# Altium schematic sheet CoilGun_Schematic.SchDoc
size 420 x 297 mm; SheetNumber: 1; SheetTotal: 1
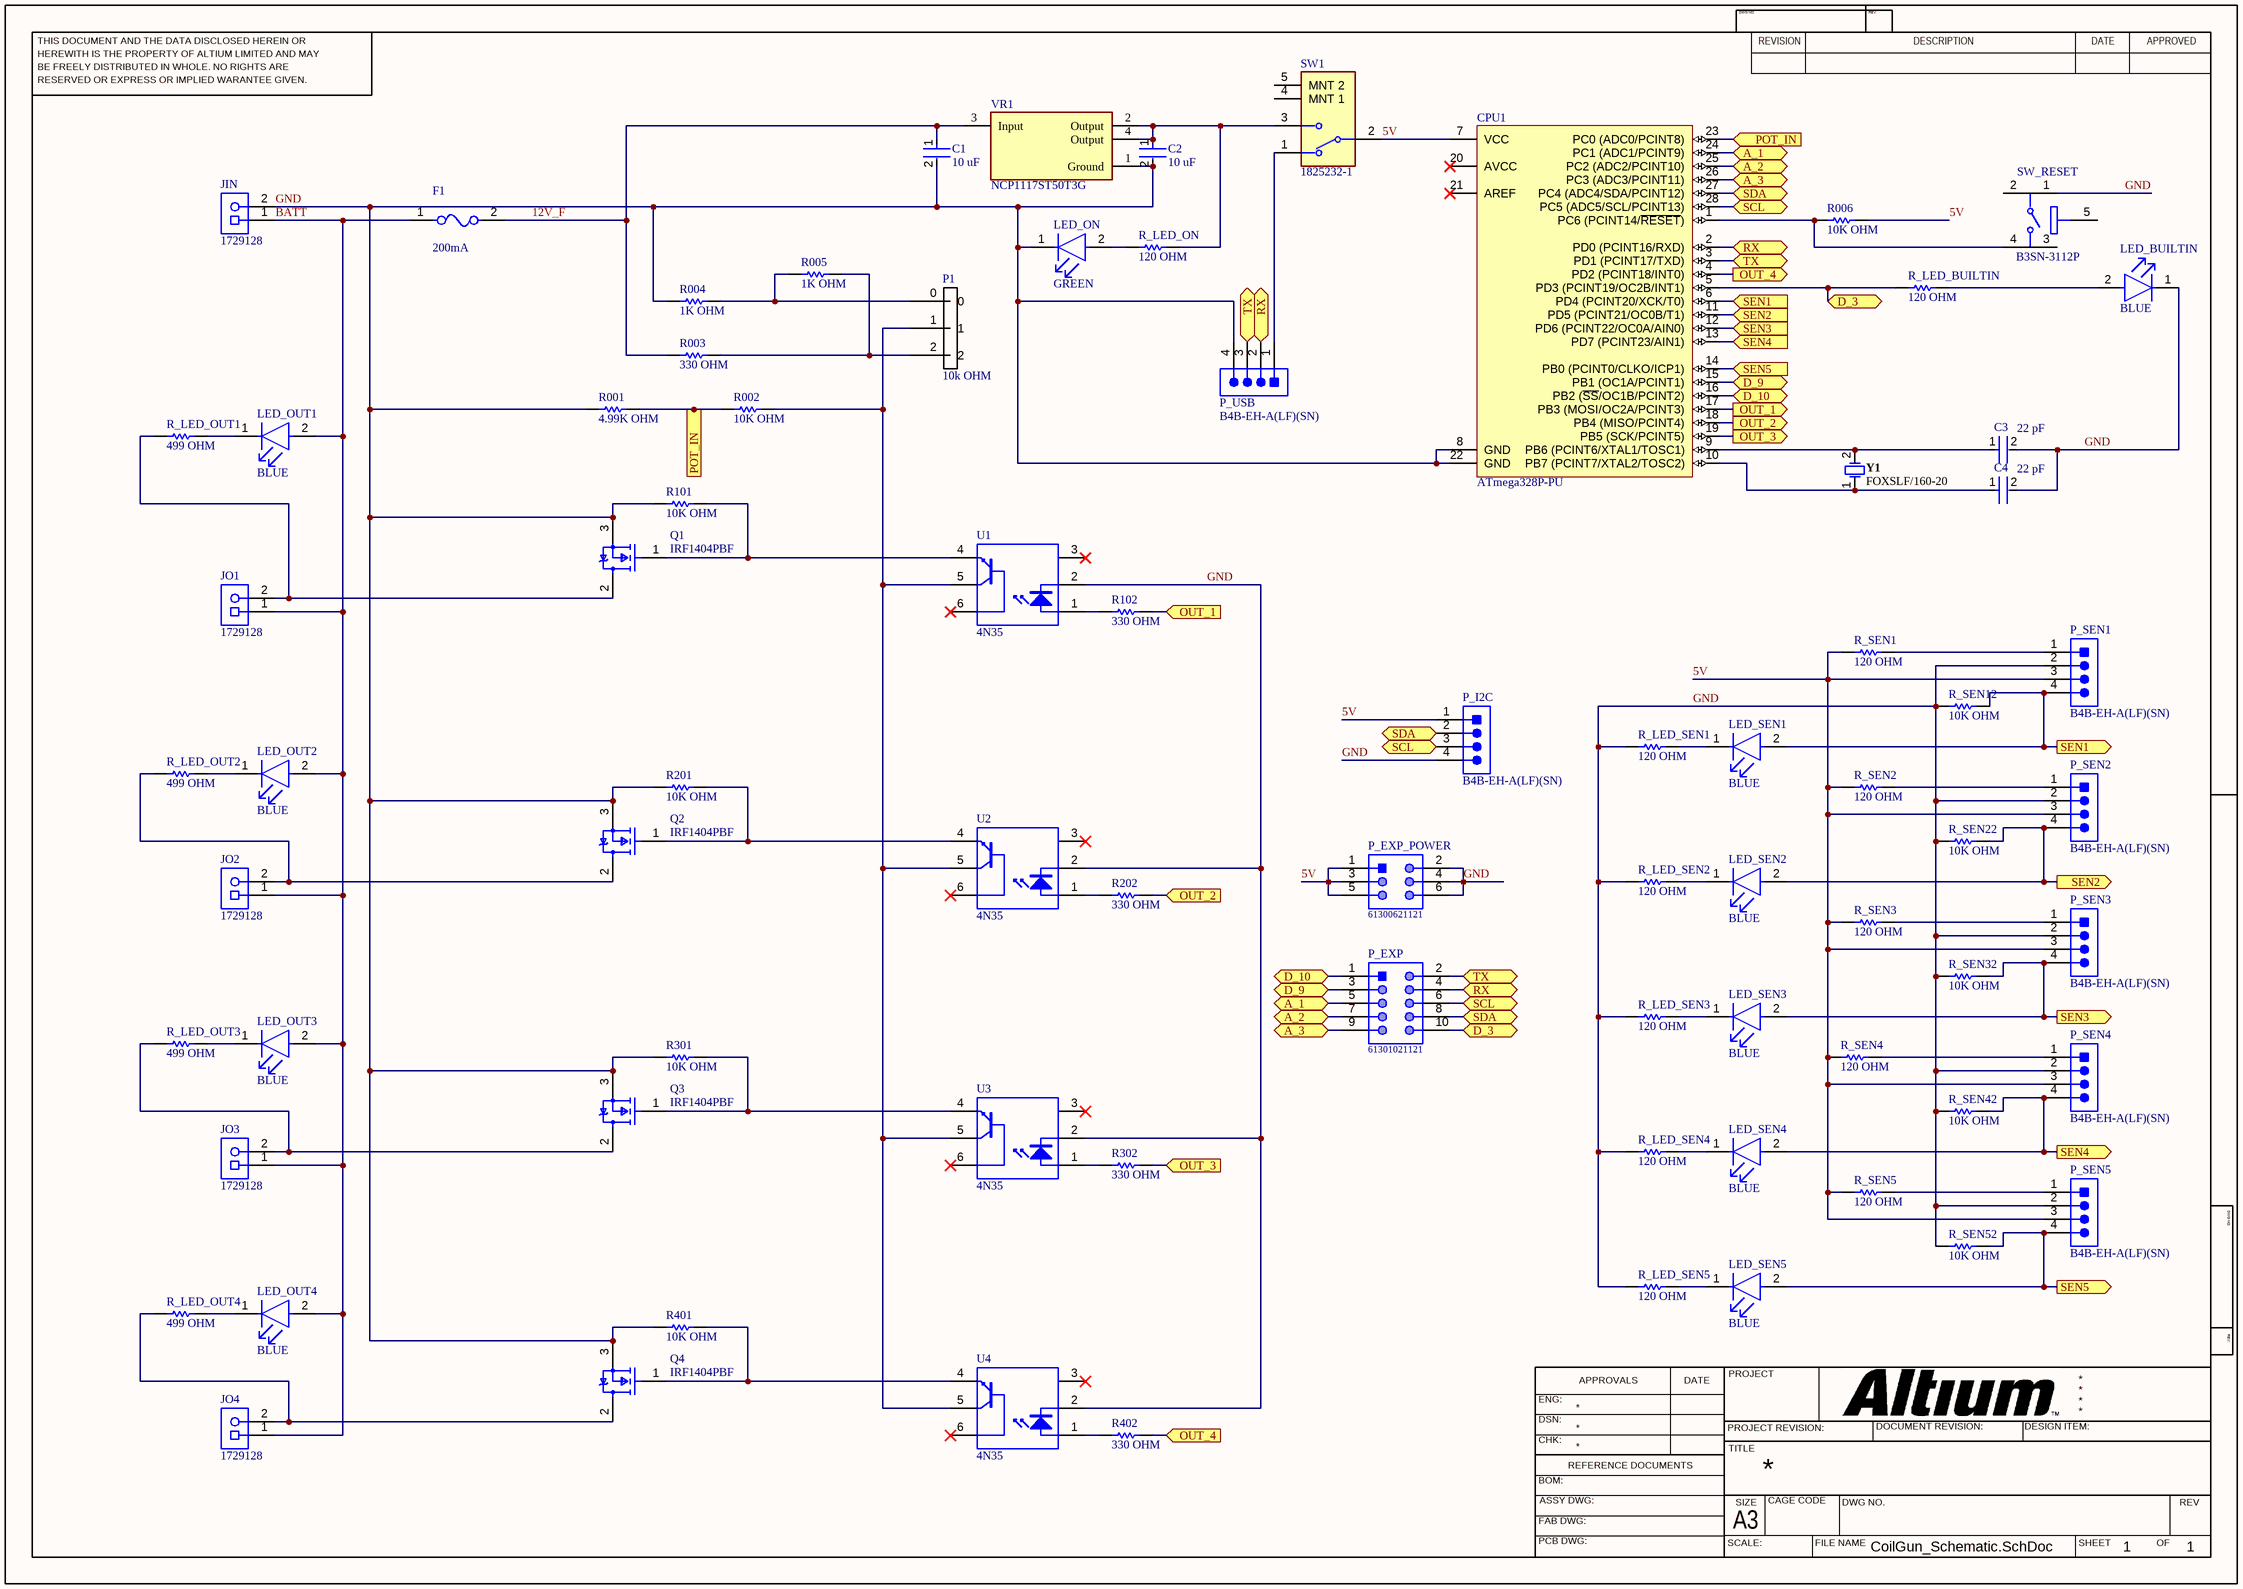
[diagram p0: CoilGun_Schematic.SchDoc]

## Parts
C1  10 uF  [FP-MK316L-MFG]
C2  10 uF  [FP-MK316L-MFG]
C3  22 pF  [FP-C0805C-DN-MFG]
C4  22 pF  [FP-C0805C-DN-MFG]
CPU1  ATmega328P-PU  [28P3]
F1  200mA  [FP-MF-R030-MFG]
JIN  1729128  [PHOE-1729128-2_V]
JO1  1729128  [PHOE-1729128-2_V]
JO2  1729128  [PHOE-1729128-2_V]
JO3  1729128  [PHOE-1729128-2_V]
JO4  1729128  [PHOE-1729128-2_V]
LED_BUILTIN  BLUE  [FP-LTST-C150AKT-MFG]
LED_ON  GREEN  [FP-LTST-C150AKT-MFG]
LED_OUT1  BLUE  [FP-LTST-C150AKT-MFG]
LED_OUT2  BLUE  [FP-LTST-C150AKT-MFG]
LED_OUT3  BLUE  [FP-LTST-C150AKT-MFG]
LED_OUT4  BLUE  [FP-LTST-C150AKT-MFG]
LED_SEN1  BLUE  [FP-LTST-C150AKT-MFG]
LED_SEN2  BLUE  [FP-LTST-C150AKT-MFG]
LED_SEN3  BLUE  [FP-LTST-C150AKT-MFG]
LED_SEN4  BLUE  [FP-LTST-C150AKT-MFG]
LED_SEN5  BLUE  [FP-LTST-C150AKT-MFG]
P1  10k OHM  [POT]
P_EXP  61301021121  [61301021121]
P_EXP_POWER  61300621121  [61300621121]
P_I2C  B4B-EH-A(LF)(SN)  [JST-B4B-EH-A_V]
P_SEN1  B4B-EH-A(LF)(SN)  [JST-B4B-EH-A_V]
P_SEN2  B4B-EH-A(LF)(SN)  [JST-B4B-EH-A_V]
P_SEN3  B4B-EH-A(LF)(SN)  [JST-B4B-EH-A_V]
P_SEN4  B4B-EH-A(LF)(SN)  [JST-B4B-EH-A_V]
P_SEN5  B4B-EH-A(LF)(SN)  [JST-B4B-EH-A_V]
P_USB  B4B-EH-A(LF)(SN)  [JST-B4B-EH-A_V]
Q1  IRF1404PBF  [FP-PG-TO220-3-MFG]
Q2  IRF1404PBF  [FP-PG-TO220-3-MFG]
Q3  IRF1404PBF  [FP-PG-TO220-3-MFG]
Q4  IRF1404PBF  [FP-PG-TO220-3-MFG]
R001  4.99K OHM  [RESC3116X65X40LL10T20]
R002  10K OHM  [RESC3116X65X40ML10T20]
R003  330 OHM  [RESC2013X60X35LL10T20]
R004  1K OHM  [RESC3116X65X40ML10T20]
R005  1K OHM  [RESC3116X65X40ML10T20]
R006  10K OHM  [RESC3116X65X40ML10T20]
R101  10K OHM  [RESC3116X65X40ML10T20]
R102  330 OHM  [RESC2013X60X35LL10T20]
R201  10K OHM  [RESC3116X65X40ML10T20]
R202  330 OHM  [RESC2013X60X35LL10T20]
R301  10K OHM  [RESC3116X65X40ML10T20]
R302  330 OHM  [RESC2013X60X35LL10T20]
R401  10K OHM  [RESC3116X65X40ML10T20]
R402  330 OHM  [RESC2013X60X35LL10T20]
R_LED_BUILTIN  120 OHM  [RESC3216X70X50ML20T25]
R_LED_ON  120 OHM  [RESC3216X70X50ML20T25]
R_LED_OUT1  499 OHM  [RESC1206(3216)_N]
R_LED_OUT2  499 OHM  [RESC1206(3216)_N]
R_LED_OUT3  499 OHM  [RESC1206(3216)_N]
R_LED_OUT4  499 OHM  [RESC1206(3216)_N]
R_LED_SEN1  120 OHM  [RESC3216X70X50ML20T25]
R_LED_SEN2  120 OHM  [RESC3216X70X50ML20T25]
R_LED_SEN3  120 OHM  [RESC3216X70X50ML20T25]
R_LED_SEN4  120 OHM  [RESC3216X70X50ML20T25]
R_LED_SEN5  120 OHM  [RESC3216X70X50ML20T25]
R_SEN1  120 OHM  [RESC3216X70X50ML20T25]
R_SEN2  120 OHM  [RESC3216X70X50ML20T25]
R_SEN3  120 OHM  [RESC3216X70X50ML20T25]
R_SEN4  120 OHM  [RESC3216X70X50ML20T25]
R_SEN5  120 OHM  [RESC3216X70X50ML20T25]
R_SEN12  10K OHM  [RESC3116X65X40ML10T20]
R_SEN22  10K OHM  [RESC3116X65X40ML10T20]
R_SEN32  10K OHM  [RESC3116X65X40ML10T20]
R_SEN42  10K OHM  [RESC3116X65X40ML10T20]
R_SEN52  10K OHM  [RESC3116X65X40ML10T20]
SW1  1825232-1  [FP-1825232-1-MFG]
SW_RESET  B3SN-3112P  [FP-B3SN-3112P-MFG]
U1  4N35  [LTST-DIP-6_A]
U2  4N35  [LTST-DIP-6_A]
U3  4N35  [LTST-DIP-6_A]
U4  4N35  [LTST-DIP-6_A]
VR1  NCP1117ST50T3G  [FP-318H-MFG]
Y1  FOXSLF/160-20  [FOX-FOXSLF160-20]

## Ports
A_1 (bidir), A_2 (bidir), A_3 (bidir), D_3 (bidir), D_9 (bidir), D_10 (bidir), OUT_1 (in), OUT_1 (out), OUT_2 (in), OUT_2 (out), OUT_3 (in), OUT_3 (out), OUT_4 (in), OUT_4 (out), POT_IN (in), POT_IN (out), RX (bidir), SCL (bidir), SDA (bidir), SEN1 (in), SEN1 (out), SEN2 (in), SEN2 (out), SEN3 (in), SEN3 (out), SEN4 (in), SEN4 (out), SEN5 (in), SEN5 (out), TX (bidir)

## Nets
5V: CPU1.7(VCC) P_EXP_POWER.1 P_EXP_POWER.3 P_EXP_POWER.5 P_I2C.1 P_SEN1.3 P_SEN2.3 P_SEN3.3 P_SEN4.3 P_SEN5.3 R006.2 R_SEN1.1 R_SEN2.1 R_SEN3.1 R_SEN4.1 R_SEN5.1 SW1.2
12V_F: C1.1 F1.2 R003.1 VR1.3(Input)
A_1: CPU1.24(PC1_(ADC1/PCINT9)) P_EXP.5 ; port A_1
A_2: CPU1.25(PC2_(ADC2/PCINT10)) P_EXP.7 ; port A_2
A_3: CPU1.26(PC3_(ADC3/PCINT11)) P_EXP.9 ; port A_3
BATT: F1.1 JIN.1 JO1.1 JO2.1 JO3.1 JO4.1 LED_OUT1.2(A) LED_OUT2.2(A) LED_OUT3.2(A) LED_OUT4.2(A)
D_3: CPU1.5(PD3_(PCINT19/OC2B/INT1)) P_EXP.10 R_LED_BUILTIN.1 ; port D_3
D_9: CPU1.15(PB1_(OC1A/PCINT1)) P_EXP.3 ; port D_9
D_10: CPU1.16(PB2_(~{SS}/OC1B/PCINT2)) P_EXP.1 ; port D_10
GND: C1.2 C2.2 C3.2 C4.2 CPU1.8(GND) CPU1.22(GND) JIN.2 LED_BUILTIN.1(C) LED_ON.1(C) P_EXP_POWER.2 P_EXP_POWER.4 P_EXP_POWER.6 P_I2C.4 P_SEN1.2 P_SEN2.2 P_SEN3.2 P_SEN4.2 P_SEN5.2 P_USB.4 Q1.3(SOURCE) Q2.3(SOURCE) Q3.3(SOURCE) Q4.3(SOURCE) R001.1 R004.1 R101.1 R201.1 R301.1 R401.1 R_LED_SEN1.1 R_LED_SEN2.1 R_LED_SEN3.1 R_LED_SEN4.1 R_LED_SEN5.1 R_SEN12.1 R_SEN22.1 R_SEN32.1 R_SEN42.1 R_SEN52.1 SW_RESET.1 U1.2(C) U2.2(C) U3.2(C) U4.2(C) VR1.1(Ground)
OUT_1: CPU1.17(PB3_(MOSI/OC2A/PCINT3)) R102.2 ; port OUT_1
OUT_2: CPU1.18(PB4_(MISO/PCINT4)) R202.2 ; port OUT_2
OUT_3: CPU1.19(PB5_(SCK/PCINT5)) R302.2 ; port OUT_3
OUT_4: CPU1.4(PD2_(PCINT18/INT0)) R402.2 ; port OUT_4
POT_IN: CPU1.23(PC0_(ADC0/PCINT8)) R001.2 R002.1 ; port POT_IN
RX: CPU1.2(PD0_(PCINT16/RXD)) P_EXP.4 P_USB.2 ; port RX
SCL: CPU1.28(PC5_(ADC5/SCL/PCINT13)) P_EXP.6 P_I2C.3 ; port SCL
SDA: CPU1.27(PC4_(ADC4/SDA/PCINT12)) P_EXP.8 P_I2C.2 ; port SDA
SEN1: CPU1.6(PD4_(PCINT20/XCK/T0)) LED_SEN1.2(A) P_SEN1.4 R_SEN12.2 ; port SEN1
SEN2: CPU1.11(PD5_(PCINT21/OC0B/T1)) LED_SEN2.2(A) P_SEN2.4 R_SEN22.2 ; port SEN2
SEN3: CPU1.12(PD6_(PCINT22/OC0A/AIN0)) LED_SEN3.2(A) P_SEN3.4 R_SEN32.2 ; port SEN3
SEN4: CPU1.13(PD7_(PCINT23/AIN1)) LED_SEN4.2(A) P_SEN4.4 R_SEN42.2 ; port SEN4
SEN5: CPU1.14(PB0_(PCINT0/CLKO/ICP1)) LED_SEN5.2(A) P_SEN5.4 R_SEN52.2 ; port SEN5
TX: CPU1.3(PD1_(PCINT17/TXD)) P_EXP.2 P_USB.3 ; port TX
NetC2_1: C2.1 R_LED_ON.2 SW1.3 VR1.2(Output) VR1.4(Output)
NetC3_1: C3.1 CPU1.9(PB6_(PCINT6/XTAL1/TOSC1)) Y1.2
NetC4_1: C4.1 CPU1.10(PB7_(PCINT7/XTAL2/TOSC2)) Y1.1
NetCPU1_1: CPU1.1(PC6_(PCINT14/~{RESET})) R006.1 SW_RESET.4
NetJO1_2: JO1.2 Q1.2(DRAIN) R_LED_OUT1.1
NetJO2_2: JO2.2 Q2.2(DRAIN) R_LED_OUT2.1
NetJO3_2: JO3.2 Q3.2(DRAIN) R_LED_OUT3.1
NetJO4_2: JO4.2 Q4.2(DRAIN) R_LED_OUT4.1
NetLED_BUILTIN_2: LED_BUILTIN.2(A) R_LED_BUILTIN.2
NetLED_ON_2: LED_ON.2(A) R_LED_ON.1
NetLED_OUT1_1: LED_OUT1.1(C) R_LED_OUT1.2
NetLED_OUT2_1: LED_OUT2.1(C) R_LED_OUT2.2
NetLED_OUT3_1: LED_OUT3.1(C) R_LED_OUT3.2
NetLED_OUT4_1: LED_OUT4.1(C) R_LED_OUT4.2
NetLED_SEN1_1: LED_SEN1.1(C) R_LED_SEN1.2
NetLED_SEN2_1: LED_SEN2.1(C) R_LED_SEN2.2
NetLED_SEN3_1: LED_SEN3.1(C) R_LED_SEN3.2
NetLED_SEN4_1: LED_SEN4.1(C) R_LED_SEN4.2
NetLED_SEN5_1: LED_SEN5.1(C) R_LED_SEN5.2
NetP1_0: P1.0 R004.2 R005.1
NetP1_1: P1.1 R002.2 U1.5(C) U2.5(C) U3.5(C) U4.5(C)
NetP1_2: P1.2 R003.2 R005.2
NetP_SEN1_1: P_SEN1.1 R_SEN1.2
NetP_SEN2_1: P_SEN2.1 R_SEN2.2
NetP_SEN3_1: P_SEN3.1 R_SEN3.2
NetP_SEN4_1: P_SEN4.1 R_SEN4.2
NetP_SEN5_1: P_SEN5.1 R_SEN5.2
NetP_USB_1: P_USB.1 SW1.1
NetQ1_1: Q1.1(GATE) R101.2 U1.4(E)
NetQ2_1: Q2.1(GATE) R201.2 U2.4(E)
NetQ3_1: Q3.1(GATE) R301.2 U3.4(E)
NetQ4_1: Q4.1(GATE) R401.2 U4.4(E)
NetR102_1: R102.1 U1.1(A)
NetR202_1: R202.1 U2.1(A)
NetR302_1: R302.1 U3.1(A)
NetR402_1: R402.1 U4.1(A)

Not connected (* = marked no-connect by the designer): CPU1 20(AVCC)* 21(AREF)*; SW1 4(MNT_1) 5(MNT_2); SW_RESET 2 3 5; U1 3(NC)* 6(B)*; U2 3(NC)* 6(B)*; U3 3(NC)* 6(B)*; U4 3(NC)* 6(B)*

## Notes on the sheet
- THIS DOCUMENT AND THE DATA DISCLOSED HEREIN OR
- HEREWITH IS THE PROPERTY OF ALTIUM LIMITED AND MAY
- DWG NO:
- REVISION
- REV:
- DESCRIPTION
- DATE
- APPROVED
- BE FREELY DISTRIBUTED IN WHOLE. NO RIGHTS ARE
- RESERVED OR EXPRESS OR IMPLIED WARANTEE GIVEN.
- ENG:
- APPROVALS
- PROJECT
- DSN:
- CHK:
- REFERENCE DOCUMENTS
- PROJECT REVISION:
- TITLE
- DOCUMENT REVISION:
- DESIGN ITEM:
- BOM:
- FAB DWG:
- PCB DWG:
- ASSY DWG:
- SCALE:
- A3
- SIZE
- CAGE CODE
- FILE NAME
- DWG NO.
- SHEET
- OF
- REV

## Library data of the parts
C1 C2 = CMP-2000-06325-2: CAP CER 10UF 35V X5R 1206; Tolerance: 10%; RoHS Compliant: Yes; Case Code (Metric): 3216; Resistor Type: Ceramic; Dielectric: X5R; Mount: Surface Mount; Termination: SMD/SMT; Case Code (Imperial): 1206; Number of Pins: 2; Package Quantity: 2000; Length: 3.2mm; Max Operating Temperature: 85°C; Voltage Rating (DC): 35V; Packaging: Tape and Reel; Construction: Flat; Voltage Rating: 35V; Height: 1.6mm; Capacitance: 10uF; Width: 1.6mm; Min Operating Temperature: -55°C; Series: M; Case/Package: 1206; Thickness: 0.071inch
C3 C4 = CMP-03020-018552-1: CAP CER 22PF 50V C0G/NP0 0805; Manufacturer Part Number: C0805C220J5GAC7210; Manufacturer: KEMET; Material: Ceramic; Temperature Coefficient: 30ppm/°C; Tolerance: 0.05; Temperature Characteristic: C0G; Capacitance: 22 pF; Octopart: https://octopart.com/c0805c220j5gac7210-kemet-3882539; Automotive: No; ComponentLink2Description: Datasheet; Temperature Range High: +125°C; Height: 0.88mm; Device Class L3: Ceramic Capacitors; Lead Free: Yes; Package: C0805C-DN; Digikey Description: CAP CER 22PF 50V C0G/NP0 0805; Ipc Land Pattern Name: CAPC200125X78; Value: 22 pF; Temperature: -55°C to +125°C; Voltage Rating: 50 V; Category: Cap; ComponentLink2URL: https://content.kemet.com/datasheets/KEM_C1003_C0G_SMD.pdf; RoHS: TRUE; Temperature Range Low: -55°C; Device Class L2: Capacitors; Device Class L1: Passive Components
CPU1 = CMP-0095-00013-2: 8-bit AVR Microcontroller, 32KB Flash, 1KB EEPROM, 2KB SRAM, 28-pin PDIP, Industrial Grade (-40°C to 85°C); RevisionNote: DatasheetVersion updated. URLs added.; PackageVersion: revB, Sep-2001; PackageDescription: 28-lead (0.300"/7.62mm Wide) Plastic Dual Inline Package (PDIP); DatasheetVersion: revD, May-2011; ComponentLink1Description: Manufacturer URL; ComponentLink1URL: http://www.atmel.com/; PackageReference: 28P3; ComponentLink2Description: ATmega48A/48PA/88A/88PA/168A/168PA/328/328P Datasheet; ComponentLink3URL: http://www.atmel.com/dyn/resources/prod_documents/8271S.pdf; ComponentLink2URL: http://www.atmel.com/dyn/resources/prod_documents/8271.pdf; ComponentLink3Description: ATmega48A/48PA/88A/88PA/168A/168PA/328/328P Summary
F1 = CMP-07400-000019-1: PTC RESET FUSE 60V 300MA RADIAL; Manufacturer: Bourns Inc.; Manufacturer Part Number: MF-R030; Resistance: 0.76-1.36Ω; Standoff Height: 7.6mm; Current Rating: 40A; Value: 0.76-1.36Ω; Trip Current: 0.6A; Trip Time: 3s; Hold Current: 0.3A; Voltage Rating: 60V; ComponentLink2Description: Datasheet; ComponentLink2URL: https://www.bourns.com/docs/product-datasheets/mfr.pdf?sfvrsn=bc732717_36; RoHS: TRUE; Package: MF-R030; Device Class L2: PTC Resettable Fuses; Octopart: https://octopart.com/mf-r030-bourns-23363; Temperature Range High: +85°C; Digikey Description: PTC RESET FUSE 60V 300MA RADIAL; Temperature: -40°C to +85°C; Device Class L3: unset; Mouser Description: Resettable Fuses - PPTC 60v Max 40Amps Max Hold .30 Trip .60; Category: Fuse; Temperature Range Low: -40°C; Automotive: No; Device Class L1: Circuit Protection; Height: 13.4mm; Lead Free: Yes
JIN JO1-JO4 = CMP-2000-05815-1: PCB Terminal Block, 13.5 A, 400 V, 2-Pin THD, RoHS, Bulk; Manufacturer: Phoenix Contact; Package Version: 03/2015; No. of Rows: 1; Pitch: 5.08mm; No. of Positions: 2; Voltage Rating: 400V; Current Rating: 13500mA; Manufacturer URL: http://www.phoenixcontact.com/; Datasheet URL: https://datasheet.ciiva.com/16046/1729128-16046181.pdf; RoHS: TRUE; Package URL: https://www.phoenixcontact.com/online/portal/pi/pxc/product_detail_page/!ut/p/b1/3VdJjqNKFDxLH8AFycySyWY2ozFsEPOMMQaDOX1XedGL_1Vdm5YXJleknhSKeBkvI6EA8ncAo3AYoDhBQGco6KN7VURTdemj9us_IEKEZo_YHiPAEWEFmDGOHMORkqKYCORBZxgL7ZoaZYcbFFUZ3fqxSY6GOuxydWUuHqz1ynmMFygu583Bob0Ewr6Sd_l-5m-kAueHiB0jpRwZwe58wwtkpxtMYd_LmGcDRU02dRNEyWt6Y2ti5pSyJ_reIkzIulrqApdnbT11V5jnCKbYNCvhEM1MCpPByat_X379-iThf08CI5GfOPqfBeS3BRoBOdD55AKVv0iLwCMq-2BrzXWSGRH7pUGD9uwXQjiph3xL0DKQwdGa0JImiIOmBNOestqgwTHSSs2oOep-78apyXQBvNi8ZLaFjvjWvcaUEBu0MC6Wbe-d6mB0FAebo2lUWinqYaZs5DAYzV0RP9yitUjnGJ0iI9xhZkT42OCQNUJJhkgWINNQLP2JFP6OpMg3JCVg70jqHT0lvKOnhHf0lPuOnnLf0VPuWx6_dxwUIvwk5WMkT0kLL1mh61l2yZVSzG3pYV_bqo-mj6uMKwKwdnnW8Jh5RTOJzMOA5c-eJDaZQw4mTMPH02PvS_ZAqNVjVTo2WyYLkwH_KU1mmmG5kjRhDqPXLwwVHvVOjCM60-fpXvTDfMGW1PVFVS1r4e4yVDk4ZdNbkUHvqPqQSeian4UD39fNKmachqdJ1NJbyk8rXT9mXTvPk3oE5meulKGgiruPJek-4I9hTT6G8ZLOyRSm2RRVbThERQad5OS28hdt4YW4vG0stgYYzsWsK4_7y6DZMjJSCqri1kyiZR5vD7pwIrNR7QwPHTcLTI5qT7eRlpHrdGiupYlqQDJ7zy_CND8fWWBoLRXxk1RVcXiBQwbTD4Xi7KL-FuO94t9xaqweXzH; PartNumber: 1729128; Package Description: 2-Pin Through Hole Device, Body 8.1 x 10.16 mm, Pitch 5.08 mm; Datasheet Version: 12/2013; Mounting Technology: ThroughHole; Orientation: Horizontal; Package Reference: 1729128-2; Packing: Bulk
LED_BUILTIN LED_ON LED_OUT1-LED_OUT4 LED_SEN1-LED_SEN5 = CMP-22017-000004-1: LED AMBER CLEAR SMD; Manufacturer: Lite-On; Manufacturer Part Number: LTST-C150AKT; Luminous Intensity: 6mcd; Viewing Angle: 130°; Wavelength: 602nm; Reverse Voltage: 5V; Forward Current: 30mA; Led Orientation: Top View; Power Dissipation: 100mW; Peak Emmision Wavelength: 610nm; Forward Voltage: 2.1V; ComponentLink2Description: Datasheet; Device Class L3: unset; Height: 1.2mm; RoHS: TRUE; ComponentLink2URL: https://media.digikey.com/pdf/Data%20Sheets/Lite-On%20PDFs/LTST-C150AKT.pdf; Temperature: -55°C to +85°C; Package: 0; Automotive: No; Temperature Range Low: -55°C; Device Class L2: LEDs; Device Class L1: Optoelectronics; Octopart: https://octopart.com/ltst-c150akt-lite-on-549804; Digikey Description: LED AMBER CLEAR SMD; Colour: Amber; Category: Diode; Mouser Description: Standard LEDs - SMD Amber Clear 602nm; Lead Free: Yes; Temperature Range High: +85°C
P1 = POT
P_EXP = CMP-1502-01084-1: THT Vertical Pin Header WR-PHD, Pitch 2.54 mm, Dual Row, 10 pins; Manufacturer: Wurth Elektronik; Working Voltage: 250VAC; Pitch: 2.54mm; Contact Resistance: 20mOhm; Gender: Male; Rated Current: 3A; Withstanding Voltage: 500VAC; Pin Number: 10; Operating Temperature: -40to105degC; Mounting Technology: THT; Publisher: WurthElektronik; Manufacturer URL: http://www.we-online.de; Part Number: 61301021121; Row Number: Dual; Packaging: Bag; Orientation: Vertical; Package Reference: 61301021121; Datasheet URL: https://katalog.we-online.de/em/datasheet/6130xx21121.pdf
P_EXP_POWER = CMP-1502-01072-1: THT Vertical Pin Header WR-PHD, Pitch 2.54 mm, Dual Row, 6 pins; Manufacturer: Wurth Elektronik; Contact Resistance: 20mOhm; Withstanding Voltage: 500VAC; Pin Number: 6; Gender: Male; Pitch: 2.54mm; Working Voltage: 250VAC; Rated Current: 3A; Packaging: Bag; Row Number: Dual; Manufacturer URL: http://www.we-online.de; Part Number: 61300621121; Operating Temperature: -40to105degC; Mounting Technology: THT; Package Reference: 61300621121; Datasheet URL: https://katalog.we-online.de/em/datasheet/6130xx21121.pdf; Orientation: Vertical; Publisher: WurthElektronik
P_I2C P_SEN1-P_SEN5 P_USB = CMP-2000-05904-1: Male Header, Pitch 2.5 mm, 1 x 4 Position, Height 6 mm, Tail Length 3.2 mm, -25 to 85 degC, RoHS, Bulk; Manufacturer: JST; Style/Orientation: StraightHeader/Plug; Pitch: 2.5mm; No of Positions: 4; Mounting Technology: SurfaceMount; Package Description: Male Header, Pitch 2.5 mm, 1 x 4 Position, Height 6 mm, Tail Length 3.2 mm; Datasheet Version: 12/2012; Type: ShroudedHeader; Package Reference: B4B-EH-A; Manufacturer URL: http://www.jst.com/home2.html; Termination: Crimp; Datasheet URL: http://www.jst-mfg.com/product/pdf/eng/eEH.pdf
Q1-Q4 = CMP-32901-000149-1: MOSFET N-CH 40V 202A TO-220AB; Manufacturer: Infineon Technologies; Power Dissipation: 333W; Standoff Height: 3.37mm; Number Of Channels: 1; Depletion Mode: False; Turn On Delay Time: 17ns; Turn Off Delay Time: 46ns; Gate Charge At Vgs: 131nC @ 10V; Pulse Drain Current: 808A; Reverse Recovery Charge: 163nC; Gate To Source Voltage: 20V; Threshold Vgs Min: 2V; Max Junction Temp: +175°C; Max Forward Diode Voltage: 1.5V; Transconductance: 76S; Rthja Max: 62°C/W; Drain To Source Resistance: 0.0035Ω; Reverse Recovery Time: 78ns; Threshold Vgs Max: 4V; Input Capacitace At Vds: 5669pF @ 25V; Category: Trans; Temperature Range High: +175°C; Continuous Drain Current: 202A; Temperature Range Low: -55°C; Drain To Source Breakdown Voltage: 40V; Manufacturer Part Number: IRF1404PBF; Package: PG-TO220-3; ComponentLink2Description: Datasheet; Device Class L2: Transistors; Number Of N Channels: 1; Drain To Source Voltage: 40V; Temperature: -55°C to +175°C; Device Class L3: MOSFETs; Height: 19.8mm; Octopart: https://octopart.com/irf1404pbf-infineon-65873280; Automotive: No; Footprint Url: https://www.infineon.com/dgdl/po-to220ab-fp.pdf?fileId=5546d462580663ef0158068cfbee01be; RoHS: TRUE; ComponentLink2URL: https://www.infineon.com/dgdl/irf1404pbf.pdf?fileId=5546d462533600a4015355dae92618b0; Device Class L1: Discrete Semiconductors; Lead Free: Yes; Digikey Description: MOSFET N-CH 40V 202A TO-220AB
R001 = CMP-2003-03782-1: Manufacturer: Yageo
R002 R006 R101 R201 R301 R401 R_SEN12 R_SEN22 R_SEN32 R_SEN42 R_SEN52 = CMP-1014-00623-2: Chip Resistor, 10 KOhm, +/- 1%, 0.25 W, -55 to 155 degC, 1206 (3216 Metric), RoHS, Tape and Reel; Manufacturer: Yageo; Voltage Rating: 200V; Resistance: 10KOhm; Temperature Coefficient: 100ppm/degreesC; Power Rating: 250mW; Packaging: TapeandReel; Termination: SMD/SMT; REACH SVHC: Unknown; Tolerance: 1%; Height: 0.55mm; Composition: ThickFilm; Max Operating Temperature: 155degC; Datasheet Version: Rev. 5, 10/2016; Lead Free: LeadFree; Case Code (Metric): 3216; Depth: 1.6mm; Package Quantity: 5000; RoHSCompliant: true; Military Standard: Not; Case/Package: 1206; Case Code (Imperial): 1206; Min Operating Temperature: -55degC; Datasheet URL: http://www.yageo.com/NewPortal/yageodocoutput?fileName=/pdf/R-Chip/PYu-RC_Group_51_RoHS_L_5.pdf; Length: 3.1mm; Manufacturer URL: http://www.yageo.com/; Package Reference: 1206.0; Width: 1.6mm; Package Description: 2-Pin Surface Mount Device, Body 3.1 x 1.6 mm
R003 R102 R202 R302 R402 = CMP-2000-06960-1: Chip Resistor, 330 Ohm, +/- 1%, 125 mW, -55 to 155 degC, 0805 (2012 Metric), RoHS, Tape and Reel; Manufacturer: Yageo; Voltage Rating: 150V; Temperature Coefficient: 100PPM/C; Power Rating: 125mW(1/8W); Resistance: 330Ohms; Datasheet Version: Rev. 7, 05/2017; Termination Style: SMD/SMT; Case Code - mm: 2012; Package Description: 2-Pin Surface Mounted Device, Body 2 x 1.25 mm; Operating Temperature Range: -55Cto+155C; Case Code - in: 0805; Packaging: Reel; Tolerance: 1%; Package Reference: 0805; Mounting Technology: SurfaceMount; Product: ThickFilmResistorsGeneralPurpose; Series: RC; Manufacturer URL: http://www.yageo.com/; Datasheet URL: http://www.yageo.com/documents/recent/PYu-RC_Group_51_RoHS_L_7.pdf
R004 R005 = CMP-2100-03674-1: Chip Resistor, 100 KOhm, +/- 1%, 0.25 W, -55 to 155 degC, 1206 (3216 Metric), RoHS, Tape and Reel; Manufacturer: Yageo; Voltage Rating: 200V; Temperature Coefficient: 100ppm/degreesC; Power Rating: 250mW; Case Code (Metric): 3216; Composition: ThickFilm; Lead Free: LeadFree; Max Operating Temperature: 155degC; Case/Package: 1206; Min Operating Temperature: -55degC; Depth: 1.6mm; RoHSCompliant: true; Datasheet URL: http://www.yageo.com/NewPortal/yageodocoutput?fileName=/pdf/R-Chip/PYu-RC_Group_51_RoHS_L_5.pdf; Datasheet Version: Rev. 5, 10/2016; Package Reference: 1206.0; Packaging: TapeandReel; Resistance: 100KOhm; Manufacturer URL: http://www.yageo.com/; Tolerance: 1%; Height: 0.55mm; REACH SVHC: NoSVHC; Case Code (Imperial): 1206; Length: 3.1mm; Package Description: 2-Pin Surface Mount Device, Body 3.1 x 1.6 mm; Termination: SMD/SMT
R_LED_BUILTIN R_LED_ON R_LED_SEN1-R_LED_SEN5 R_SEN1-R_SEN5 = CMP-2003-04414-1: Part Number: ERA8AEB121V; Manufacturer: Panasonic
R_LED_OUT1-R_LED_OUT4 = CMP-1014-00476-1: 499R 0.25W 1% 1206 (3216 Metric)  SMD; Case-Metric: 3216; Value: 499.00 Ohm; Case-EIA: 1206; Technology: SMT; Tolerance: 1 %; Power: 0.25 W
SW1 = CMP-03405-000001-1: SWITCH SLIDE SPDT 200MA 30V; Manufacturer: TE Connectivity; Contact Current Rating: 0.2A; Contact Resistance: 20mΩ; Electromechanical Life: 10000Cycles; Operating Force: 200gf; Throw Configuration: SPDT; Manufacturer Part Number: 1825232-1; Temperature Range High: +70°C; Height: 3.7mm; ComponentLink2URL: https://www.te.com/commerce/DocumentDelivery/DDEController?Action=showdoc&DocId=Customer+Drawing%7F1825232%7FB2%7Fpdf%7FEnglish%7FENG_CD_1825232_B2.pdf%7F1825232-1; Mount: Through Hole; Mouser Description: Slide Switches SLIDE SWITCH SPDT Right Angle; Package: 1825232-1; Temperature: -20°C to +70°C; Automotive: No; ComponentLink2Description: Datasheet; Lead Free: Yes; Octopart: https://octopart.com/1825232-1-te+connectivity-45209882; Device Class L1: Electromechanical; Digikey Description: SWITCH SLIDE SPDT 200MA 30V; Device Class L3: Slide Switches; Device Class L2: Switches; Voltage Rating Dc: 30V; Temperature Range Low: -20°C; Category: Switch; RoHS: TRUE
SW_RESET = CMP-08834-000011-1: SWITCH TACTILE SPST-NO 0.05A 24V; Contact Resistance: 100mR; Switch Function: Off-Mom; Actuator Type: Standard; Mechanical Life: 50000Cycles; Illumination Type: Non-Illuminated; Contact Current Rating: 50mA; Switch Travel: 0.25mm; Ratings: IP67; Throw Configuration: SPST; Number of Poles: 1; Operating Force: 1.57N; Length: 6.5mm; Contact Plating: Silver; Weight: 0.007055oz; Mount: Surface Mount; Min Operating Temperature: -20°C; Package Quantity: 1; Depth: 7mm; Case/Package: SMD/SMT; Packaging: Tape and Reel; Electrical Life: 50000Cycles; Radiation Hardening: No; Max Current Rating: 50mA; Voltage Rating (DC): 24V; Termination: SMD/SMT; Max Operating Temperature: 70°C; Orientation: Straight; Contact Material: Gold; Current Rating: 50mA; Max Voltage Rating (DC): 24V; Lead Free: Lead Free
U1-U4 = CMP-2000-05615-1: Photocoupler - Phototransistor Output, 1500 Vrms, -55 to 100 degC, 6-Pin DIP, RoHS, Tube; Manufacturer: Vishay; Maximum Input Diode Current: 60mA; Output Type: DC; Maximum Collector Current: 100mA; Isolation Voltage: 5000Vrms; Maximum Power Dissipation: 70mW; Maximum Reverse Diode Voltage: 6V; Current Transfer Ratio: 50%; Number of Channels: 1Channel; Output Device: NPNPhototransistor; Brand: VishaySemiconductors; Maximum Forward Diode Voltage: 1.5V; Maximum Collector Emitter Voltage: 30V; RoHS: Details; Package Description: 6-Pin Double In-line Package, Body 7.3 x 6.5 mm, Pitch 2.54 mm; Product Category: TransistorOutputOptocouplers; Packaging: Tube; Manufacturer URL: http://www.us.liteon.com/; Minimum Operating Temperature: -55C; Package Reference: DIP-6; Input Type: DC; Datasheet Version: Rev. D, 12/2015; Datasheet URL: http://optoelectronics.liteon.com/upload/download/DS-70-99-0012/S_110_4N3X%20Series%201115.pdf; Maximum Operating Temperature: +100C; Package / Case: PDIP-6; Forward Current: 60mA; Configuration: 1Channel; Factory Pack Quantity: 3000; Number of Channels per Chip: 1Channel; Mounting Technology: ThroughHole
VR1 = CMP-0592-00001-4: IC REG LINEAR 5V 1A SOT223; Output Voltage Accuracy: 1%; Number of Outputs: 1; Dropout Voltage: 1.2V; Polarity: Positive; Power Rating: 781mW; Input Bias Current: 6mA; Quiescent Current: 10mA; Output Type: Fixed; Max Input Voltage: 20V; Min Input Voltage: 3.5V; Max Operating Temperature: 125°C; Number of Pins: 4; Case/Package: SOT-223; Min Operating Temperature: 0°C; Accuracy: 1%; Contact Plating: Tin; Min Current Limit: 1A; Output Current: 1A; Max Output Current: 1A; Length: 6.7mm; Packaging: Tape and Reel; Package Quantity: 1; Height: 1.69mm; REACH SVHC: No SVHC; Width: 3.7mm; Halogen Free: Halogen Free; RoHS Compliant: Yes; Nominal Output Voltage: 5V; Lead Free: Lead Free; Radiation Hardening: No; Tolerance: 1%; Number of Regulators: 1; Output Voltage: 5V
Y1 = CMP-1749-00003-1: Resistance Weld Thru-Hole Crystal, 16 MHz, -20 to 70 degC, 2-Pin THD, RoHS, Bulk; Voltage Rating: 250 V; Tolerance: 1%; Resistance: 221 kohm; Case\Package: Axial; Power Rating: 250 mW; RoHSCompliant: true; Package Quantity: 200; Packaging: Bulk; Min Operating Temperature: -55 degC; DatasheetVersion: Mar-15; ComponentLink1URL: http://www.foxonline.com/; Max Operating Temperature: 155 degC; PackageReference: FOXSLF160-20; Mount: Through Hole; PackageDescription: 2-Pin Through Hole Device, Body 11.35 x 4.65 mm; ComponentLink1Description: Manufacturer URL; ComponentLink2URL: http://www.foxonline.com/pdfs/hc49slf.pdf; ComponentLink2Description: Datasheet; Length: 0.248 inch